# Altium schematic sheet Main SCH.schdoc
size 306 x 421 mm
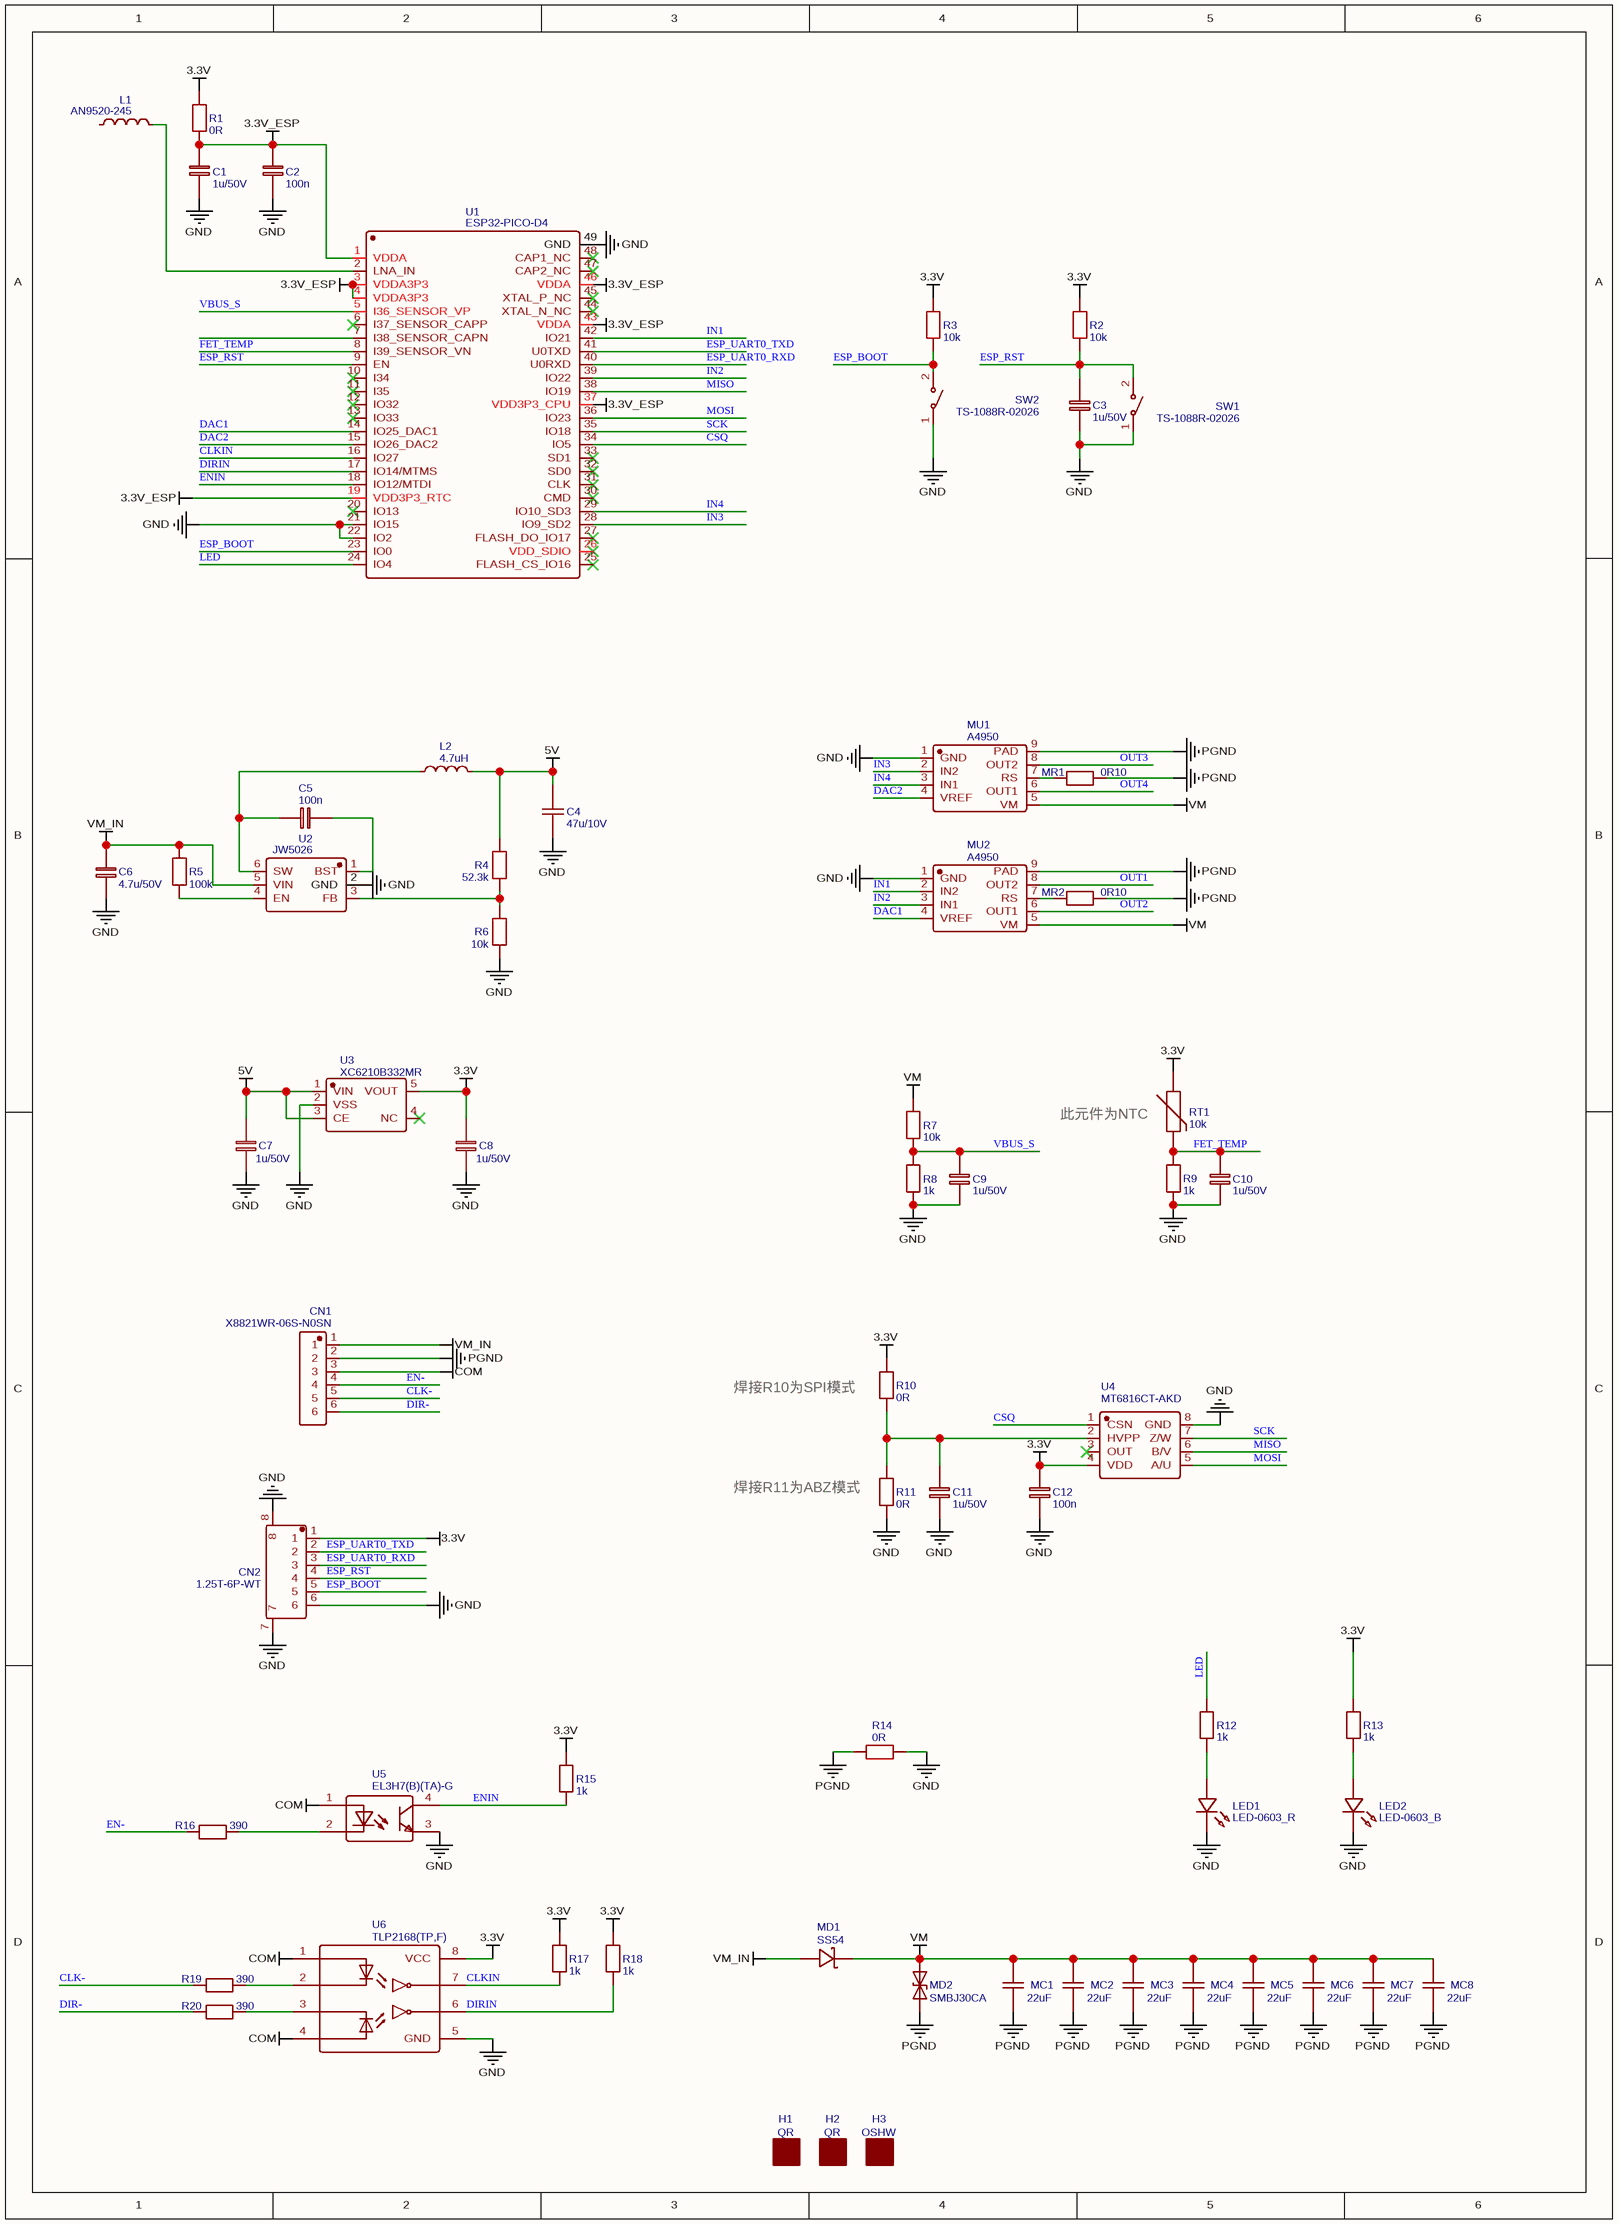
[diagram p0: Main SCH.schdoc]

## Parts
C1  1u/50V  [C0603_SMALL]
C2  100n  [C0603_SMALL]
C3  1u/50V  [C0603_SMALL]
C4  47u/10V  [C1206_SMALL]
C5  100n  [C0603_SMALL]
C6  4.7u/50V  [C1206_SMALL]
C7  1u/50V  [C0603_SMALL]
C8  1u/50V  [C0603_SMALL]
C9  1u/50V  [C0603_SMALL]
C10  1u/50V  [C0603_SMALL]
C11  1u/50V  [C0603_SMALL]
C12  100n  [C0603_SMALL]
CN1  X8821WR-06S-N0SN  [CONN-TH_6P-P2.50_X8821WR-06S-N2SN]
CN2  1.25T-6P-WT  [CONN-SMD_6P-P1.25_1.25T-6P-WT]
H1  QR  [闭环步进QQ群]
H2  QR  [闭环步进QQ群]
H3  OSHW  [OSHW_LOGO_H8]
L1  AN9520-245  [ANT-SMD_L9.5-W2.1]
L2  4.7uH  [IND-SMD_L2.5-W2.0]
LED1  LED-0603_R  [LED0603_VIOLET_SMALL]
LED2  LED-0603_B  [LED0603_BLUE_SMALL]
MC1  22uF  [C1210]
MC2  22uF  [C1210]
MC3  22uF  [C1210]
MC4  22uF  [C1210]
MC5  22uF  [C1210]
MC6  22uF  [C1210]
MC7  22uF  [C1210]
MC8  22uF  [C1210]
MD1  SS54  [SMB_L4.6-W3.6-LS5.3-R-RD]
MD2  SMBJ30CA  [SMB_L4.6-W3.6-LS5.3-BI]
MR1  0R10  [R1206]
MR2  0R10  [R1206]
MU1  A4950  [HSOP-8_L5.0-W4.0-P1.27-LS6.2-TL-EP]
MU2  A4950  [HSOP-8_L5.0-W4.0-P1.27-LS6.2-TL-EP]
R1  0R  [R0603_SMALL]
R2  10k  [R0603_SMALL]
R3  10k  [R0603_SMALL]
R4  52.3k  [R0603_SMALL]
R5  100k  [R0603_SMALL]
R6  10k  [R0603_SMALL]
R7  10k  [R0603_SMALL]
R8  1k  [R0603_SMALL]
R9  1k  [R0603_SMALL]
R10  0R  [R0603_SMALL]
R11  0R  [R0603_SMALL]
R12  1k  [R0603_SMALL]
R13  1k  [R0603_SMALL]
R14  0R  [R0603_SMALL]
R15  1k  [R0603_SMALL]
R16  390  [R0603_SMALL]
R17  1k  [R0603_SMALL]
R18  1k  [R0603_SMALL]
R19  390  [R0603_SMALL]
R20  390  [R0603_SMALL]
RT1  10k  [R0603_SMALL]
SW1  TS-1088R-02026  [SW-SMD_L3.9-W3.0-P4.45]
SW2  TS-1088R-02026  [SW-SMD_L3.9-W3.0-P4.45]
U1  ESP32-PICO-D4  [QFN-48_L7.0-W7.0-P0.50-BL-EP5.1]
U2  JW5026  [SOT-23-6_L2.9-W1.6-P0.95-LS2.8-BR]
U3  XC6210B332MR  [SOT-23-5_L3.0-W1.7-P0.95-LS2.8-BR]
U4  MT6816CT-AKD  [SOP-8_L5.0-W4.0-P1.27-LS6.2-BL]
U5  EL3H7(B)(TA)-G  [SOP-4_L4.4-W2.8-P1.27-LS7.0-TL]
U6  TLP2168(TP,F)  [SO-8_L4.9-W3.9-P1.27-LS5.9-BL]

## Nets
3.3V: C8.2 C12.2 CN2.1 R1.1 R2.1 R3.1 R10.1 R13.1 R15.1 R17.1 R18.1 RT1.2 U3.5(VOUT) U4.4(VDD) U6.8(VCC)
3.3V_ESP: C1.1 C2.1 R1.2 U1.1(VDDA) U1.3(VDDA3P3) U1.4(VDDA3P3) U1.19(VDD3P3_RTC) U1.37(VDD3P3_CPU) U1.43(VDDA) U1.46(VDDA)
5V: C4.2 C7.2 L2.2 R4.1 U3.1(VIN) U3.3(CE)
COM: CN1.3 U5.1(AN) U6.1(AN1) U6.4(AN2)
GND: C1.2 C2.2 C3.1 C4.1 C6.1 C7.1 C8.1 C9.1 C10.1 C11.1 C12.1 CN2.6 CN2.7 CN2.8 LED1.2 LED2.2 MU1.1(GND) MU2.1(GND) R6.2 R8.2 R9.2 R11.2 R14.2 SW1.1 SW2.1 U1.21(IO15) U1.22(IO2) U1.49(GND) U2.2(GND) U3.2(VSS) U4.8(GND) U5.3(EM) U6.5(GND)
PGND: CN1.2 MC1.1 MC2.1 MC3.1 MC4.1 MC5.1 MC6.1 MC7.1 MC8.1 MD2.2(A) MR1.1 MR2.1 MU1.9(PAD) MU2.9(PAD) R14.1
VM: MC1.2 MC2.2 MC3.2 MC4.2 MC5.2 MC6.2 MC7.2 MC8.2 MD1.2(K) MD2.1(K) MU1.5(VM) MU2.5(VM) R7.1
VM_IN: C6.2 CN1.1 MD1.1(A) R5.1 U2.5(VIN)
CLK-: CN1.5 R19.2
CLKIN: R17.2 U1.16(IO27) U6.7(VO1)
CSQ: U1.34(IO5) U4.1(CSN)
DAC1: MU2.4(VREF) U1.14(IO25_DAC1)
DAC2: MU1.4(VREF) U1.15(IO26_DAC2)
DIR-: CN1.6 R20.2
DIRIN: R18.2 U1.17(IO14/MTMS) U6.6(VO2)
EN-: CN1.4 R16.2
ENIN: R15.2 U1.18(IO12/MTDI) U5.4(COL)
ESP_BOOT: CN2.5 R3.2 SW2.2 U1.23(IO0)
ESP_RST: C3.2 CN2.4 R2.2 SW1.2 U1.9(EN)
ESP_UART0_RXD: CN2.3 U1.40(U0RXD)
ESP_UART0_TXD: CN2.2 U1.41(U0TXD)
FET_TEMP: C10.2 R9.1 RT1.1 U1.8(I39_SENSOR_VN)
IN1: MU2.2(IN2) U1.42(IO21)
IN2: MU2.3(IN1) U1.39(IO22)
IN3: MU1.2(IN2) U1.28(IO9_SD2)
IN4: MU1.3(IN1) U1.29(IO10_SD3)
LED: R12.1 U1.24(IO4)
MISO: U1.38(IO19) U4.6(B/V)
MOSI: U1.36(IO23) U4.5(A/U)
OUT1: MU2.8(OUT2)
OUT2: MU2.6(OUT1)
OUT3: MU1.8(OUT2)
OUT4: MU1.6(OUT1)
SCK: U1.35(IO18) U4.7(Z/W)
VBUS_S: C9.2 R7.2 R8.1 U1.5(I36_SENSOR_VP)
NetC5_1: C5.1 L2.1 U2.6(SW)
NetC5_2: C5.2 U2.1(BST)
NetC11_2: C11.2 R10.2 R11.1 U4.2(HVPP)
NetL1_1: L1.1 U1.2(LNA_IN)
NetLED1_1: LED1.1 R12.2
NetLED2_1: LED2.1 R13.2
NetMR1_2: MR1.2 MU1.7(RS)
NetMR2_2: MR2.2 MU2.7(RS)
NetR4_2: R4.2 R6.1 U2.3(FB)
NetR5_2: R5.2 U2.4(EN)
NetR16_1: R16.1 U5.2(CAT)
NetR19_1: R19.1 U6.2(CAT1)
NetR20_1: R20.1 U6.3(CAT2)

Not connected (* = marked no-connect by the designer): L1 2; U1 6(I37_SENSOR_CAPP)* 7(I38_SENSOR_CAPN) 10(I34)* 11(I35)* 12(IO32)* 13(IO33)* 20(IO13)* 25(FLASH_CS_IO16)* 26(VDD_SDIO)* 27(FLASH_DO_IO17)* 30(CMD)* 31(CLK)* 32(SD0)* 33(SD1)* 44(XTAL_N_NC)* 45(XTAL_P_NC)* 47(CAP2_NC)* 48(CAP1_NC)*; U3 4(NC)*; U4 3(OUT)*

## Notes on the sheet
- 此元件为NTC
- 焊接R10为SPI模式
- 焊接R11为ABZ模式

## Library data of the parts
C1 C3 C9-C11 = 1u/50V: BOM_Manufacturer Part: CL10A105KB8NNNC; BOM_Manufacturer: SAMSUNG; nameAlias: Value(F); spicePre: C; spiceSymbolName: Cap_0603_EU; BOM_Supplier Part: C15849; BOM_Supplier: LCSC
C2 C5 C12 = 100n: BOM_Manufacturer Part: CC0603KRX7R9BB104; BOM_Manufacturer: YAGEO; nameAlias: Value(F); spicePre: C; spiceSymbolName: Cap_0603_EU; BOM_Supplier Part: C14663; BOM_Supplier: LCSC
C4 = 47u/10V: BOM_Manufacturer: SAMSUNG; BOM_Manufacturer Part: CL31A476MPHNNNE; nameAlias: Capacitance; Contributor: LCSC; BOM_Supplier: LCSC; BOM_Supplier Part: C96123; spicePre: C; spiceSymbolName: TCC1812Y5V106Z500GT
C6 = 4.7u/50V: BOM_Manufacturer Part: 12065C475KAT4A; BOM_Manufacturer: AVX; nameAlias: Value(F); spicePre: C; spiceSymbolName: Cap_0603_EU; BOM_Supplier Part: C141667; BOM_Supplier: LCSC
C7 C8 = 1u/50V: BOM_Manufacturer Part: CL10A105KB8NNNC; BOM_Manufacturer: SAMSUNG; nameAlias: Value(F); Contributor: LCEDA_Lib; BOM_Supplier Part: C15849; BOM_Supplier: LCSC; spicePre: C; spiceSymbolName: C_0603_EU
CN1 = X8821WR-06S-N0SN: BOM_Manufacturer: XKB Enterprise; Contributor: LCSC; BOM_Supplier: LCSC; BOM_Supplier Part: C388743; BOM_Manufacturer Part: X8821WR-06S-N0SN; BOM_JLCPCB Part Class: Extended Part; spicePre: C; spiceSymbolName: X8821WR-06S-N0SN
CN2 = 1.25T-6P-WT: BOM_Manufacturer: HRO; BOM_Supplier: LCSC; BOM_Manufacturer Part: 1.25T-6P-WT; BOM_Supplier Part: C97377; BOM_JLCPCB Part Class: Extended Part; spicePre: C; spiceSymbolName: 1.25T-6P-WT
H1 H2 = QR: Contributor: snrqcf; Package Display: No; spicePre: H; spiceSymbolName: 安装孔
H3 = OSHW: Contributor: snrqcf; Package Display: No; spicePre: H; spiceSymbolName: 安装孔
L1 = AN9520-245: BOM_Manufacturer: Rainsun; BOM_Paste Type: expand; BOM_Supplier: LCSC; BOM_Manufacturer Part: AN9520-245; BOM_Supplier Part: C99665; spicePre: L; spiceSymbolName: AN9520-245
L2 = 4.7uH: BOM_Manufacturer: microgate; BOM_Manufacturer Part: MPIH252010-4R7M-LF; nameAlias: Inductance; Contributor: LCSC; BOM_Supplier: LCSC; BOM_Supplier Part: C490449; spicePre: L; spiceSymbolName: MPIH252010-4R7M-LF
LED1 = LED-0603_R: BOM_Manufacturer: EVERLIGHT(台湾亿光); BOM_Manufacturer Part: 19-217/R6C-AL1M2VY/3T; Contributor: LCEDA_01; BOM_Supplier Part: C72044; BOM_Supplier: LCSC; spicePre: L; spiceSymbolName: LED-0603_R
LED2 = LED-0603_B: BOM_Manufacturer: EVERLIGHT(台湾亿光); BOM_Manufacturer Part: 19-217/BHC-ZL1M2RY/3T; Contributor: LCEDA_01; BOM_Supplier Part: C72041; BOM_Supplier: LCSC; spicePre: L; spiceSymbolName: LED-0603_B
MC1-MC8 = 22uF: nameAlias: Capacitance; Contributor: LCSC; BOM_Supplier: LCSC; BOM_Supplier Part: C171750; spicePre: C; spiceSymbolName: TCC1210X5R107M6R3MT
MD1 = SS54: BOM_Manufacturer: MDD; SMT Type: Extend; BOM_Supplier: LCSC; BOM_Manufacturer Part: SS54; image: //image.lceda.cn/szlcsc/C32513.jpg; BOM_Supplier Part: C32513; BOM_JLCPCB SMD: Yes; spicePre: D; spiceSymbolName: SS54
MD2 = SMBJ30CA: BOM_Manufacturer Part: SMBJ15CA; BOM_Manufacturer: Shenzhen Jinkaisheng Elec; SMT Type: Extend; BOM_Supplier: LCSC; image: //image.lceda.cn/szlcsc/C78417.jpg; BOM_Supplier Part: C362083; BOM_JLCPCB SMD: Yes; spicePre: D; spiceSymbolName: SMBJ28CA
MR1 MR2 = 0R10: BOM_Manufacturer Part: STE1206A1W0R100F; BOM_Manufacturer: Walter Elec; nameAlias: Value(惟); Contributor: LCEDA_Lib; BOM_Supplier Part: C388443; BOM_Supplier: LCSC; spicePre: R; spiceSymbolName: R_0603_EU
MU1 MU2 = A4950: BOM_Manufacturer: ALLEGRO; BOM_Manufacturer Part: A4950ELJTR-T; Contributor: 矛盾聚合体; BOM_Supplier Part: C82404; BOM_Supplier: LCSC; spicePre: U; spiceSymbolName: TB67H450
R1 R14 = 0R: BOM_Manufacturer Part: 0603WAJ0000T5E; BOM_Manufacturer: UniOhm; nameAlias: Value(Ω); spicePre: R; spiceSymbolName: Res_0603(1/10W)_EU; BOM_Supplier: LCSC; BOM_Supplier Part: C15402
R2 R3 R7 = 10k: BOM_Manufacturer Part: 0603WAF1002T5E; BOM_Manufacturer: UniOhm; nameAlias: Value(Ω); Contributor: LCEDA_Lib; BOM_Supplier Part: C25804; BOM_Supplier: LCSC; spicePre: R; spiceSymbolName: R_0603_EU
R4 = 52.3k: BOM_Manufacturer Part: 0603WAF5232T5E; BOM_Manufacturer: UniOhm; nameAlias: Value(Ω); spicePre: R; spiceSymbolName: Res_0603(1/10W)_EU; BOM_Supplier: LCSC; BOM_Supplier Part: C23198
R5 = 100k: BOM_Manufacturer Part: 0603WAF1002T5E; BOM_Manufacturer: UniOhm; nameAlias: Value(Ω); spicePre: R; spiceSymbolName: Res_0603(1/10W)_EU; BOM_Supplier: LCSC; BOM_Supplier Part: C25804
R6 = 10k: BOM_Manufacturer Part: 0603WAF1002T5E; BOM_Manufacturer: UniOhm; nameAlias: Value(Ω); spicePre: R; spiceSymbolName: Res_0603(1/10W)_EU; BOM_Supplier: LCSC; BOM_Supplier Part: C25804
R8 R15 R17 R18 = 1k: BOM_Manufacturer Part: 0603WAF1001T5E; BOM_Manufacturer: UniOhm; nameAlias: Value(Ω); Contributor: LCEDA_Lib; BOM_Supplier Part: C21190; BOM_Supplier: LCSC; spicePre: R
  R8: spiceSymbolName: R_0603_EU
  R15 R17 R18: spiceSymbolName: R_0201_EU
R9 R12 R13 = 1k: BOM_Manufacturer Part: 0603WAF1001T5E; BOM_Manufacturer: UniOhm; nameAlias: Value(Ω); spicePre: R; spiceSymbolName: Res_0603(1/10W)_EU; BOM_Supplier: LCSC; BOM_Supplier Part: C21190
R10 R11 = 0R: BOM_Manufacturer Part: 0603WAJ0000T5E; BOM_Manufacturer: UniOhm; nameAlias: Value(Ω); Contributor: LCEDA_Lib; BOM_Supplier Part: C15402; BOM_Supplier: LCSC; spicePre: R; spiceSymbolName: R_0201_EU
R16 R19 R20 = 390: BOM_Manufacturer Part: 0603WAF3900T5E; BOM_Manufacturer: UniOhm; nameAlias: Value(Ω); Contributor: LCEDA_Lib; BOM_Supplier Part: C23151; BOM_Supplier: LCSC; spicePre: R; spiceSymbolName: R_0201_EU
RT1 = 10k: BOM_Manufacturer: TDK; BOM_Manufacturer Part: NTCG164BH103JT1; Contributor: LCSC; BOM_Supplier: LCSC; BOM_Supplier Part: C524451; spicePre: R; spiceSymbolName: NTCG164QH474HT1
SW1 SW2 = TS-1088R-02026: BOM_Manufacturer: XUNPU; Contributor: LCSC; SMT Type: Extend; BOM_Supplier: LCSC; BOM_Supplier Part: C455280; BOM_Manufacturer Part: TS-1088R-02026; BOM_JLCPCB SMD: Yes; spicePre: S; spiceSymbolName: TS-1088R-02026
U1 = ESP32-PICO-D4: BOM_Manufacturer: Espressif Systems; Contributor: LCSC; BOM_Paste Type: recommend; BOM_Supplier: LCSC; BOM_Supplier Part: C193707; BOM_Manufacturer Part: ESP32-PICO-D4; spicePre: U; spiceSymbolName: ESP32-PICO-D4
U2 = JW5026: BOM_Manufacturer: JoulWatt Tech; Contributor: LCSC; BOM_Supplier: LCSC; BOM_Supplier Part: C185109; BOM_Manufacturer Part: JW5026; BOM_JLCPCB Part Class: Extended Part; spicePre: U; spiceSymbolName: JW5026
U3 = XC6210B332MR: BOM_Manufacturer: Torex Semicon; Contributor: LCSC; BOM_Supplier: LCSC; BOM_Supplier Part: C424705; BOM_Manufacturer Part: XC6210B332MR; BOM_JLCPCB Part Class: Extended Part; spicePre: U; spiceSymbolName: ME6214C33M5G
U4 = MT6816CT-AKD: BOM_Manufacturer: Magn Tek; Contributor: LCSC; 详细参数: AB=1000线，Z=4LSB，PWM=1KHz; BOM_Supplier: LCSC; BOM_Supplier Part: C879561; BOM_Manufacturer Part: MT6816CT-AKD; spicePre: U; spiceSymbolName: MT6816CT-ACD
U5 = EL3H7(B)(TA)-G: BOM_Manufacturer: EVERLIGHT; BOM_Paste Type: recommend; BOM_Supplier: LCSC; BOM_Manufacturer Part: EL3H7(B)(TA)-G; image: //image.lceda.cn/szlcsc/C32565.jpg; BOM_Supplier Part: C32565; spicePre: U; spiceSymbolName: EL3H7(B)(TA)-G
U6 = TLP2168(TP,F): BOM_Manufacturer: TOSHIBA; Contributor: LCSC; BOM_Paste Type: recommend; BOM_Assembly Type: smtWeld; BOM_Supplier: LCSC; BOM_Supplier Part: C99480; BOM_Manufacturer Part: TLP2168(TP,F); spicePre: U; spiceSymbolName: TLP2168(TP,F)